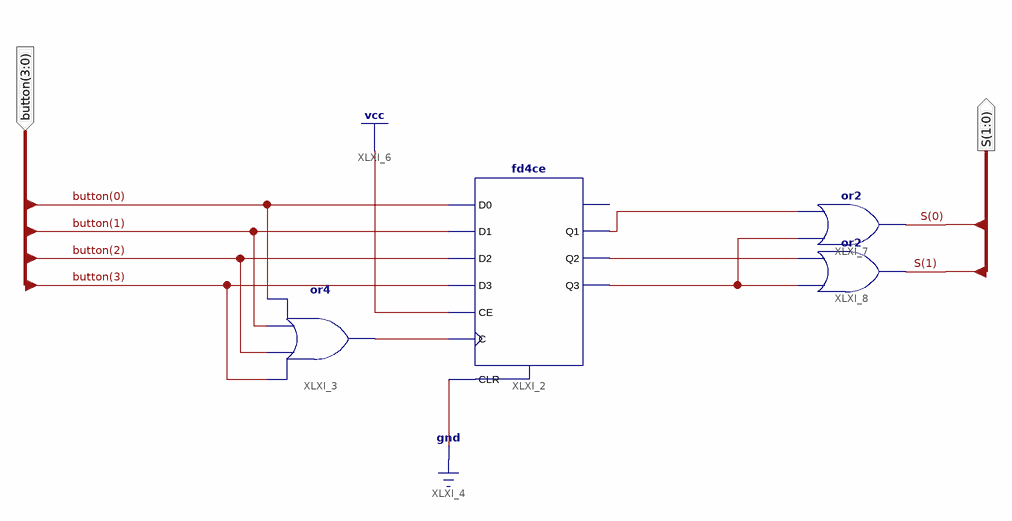
[diagram p0: schematic sheet 1]
// Xilinx ISE schematic selectMode.sch (spartan6) as structural Verilog: 4 symbols, 2 ports
module selectMode (
  input  [3:0] button,
  output [1:0] S
);

  wire XLXN_7, XLXN_21, XLXN_22, XLXN_24;

  fd4ce XLXI_2 (
    .C(XLXN_7), .CE(1'b1), .CLR(1'b0), .D0(button[0]), .D1(button[1]), .D2(button[2]), .D3(button[3]),
    .Q1(XLXN_21), .Q2(XLXN_22), .Q3(XLXN_24));  // open: Q0
  or XLXI_3 (XLXN_7, button[3], button[2], button[1], button[0]);
  or XLXI_7 (S[0], XLXN_24, XLXN_21);
  or XLXI_8 (S[1], XLXN_24, XLXN_22);
endmodule
